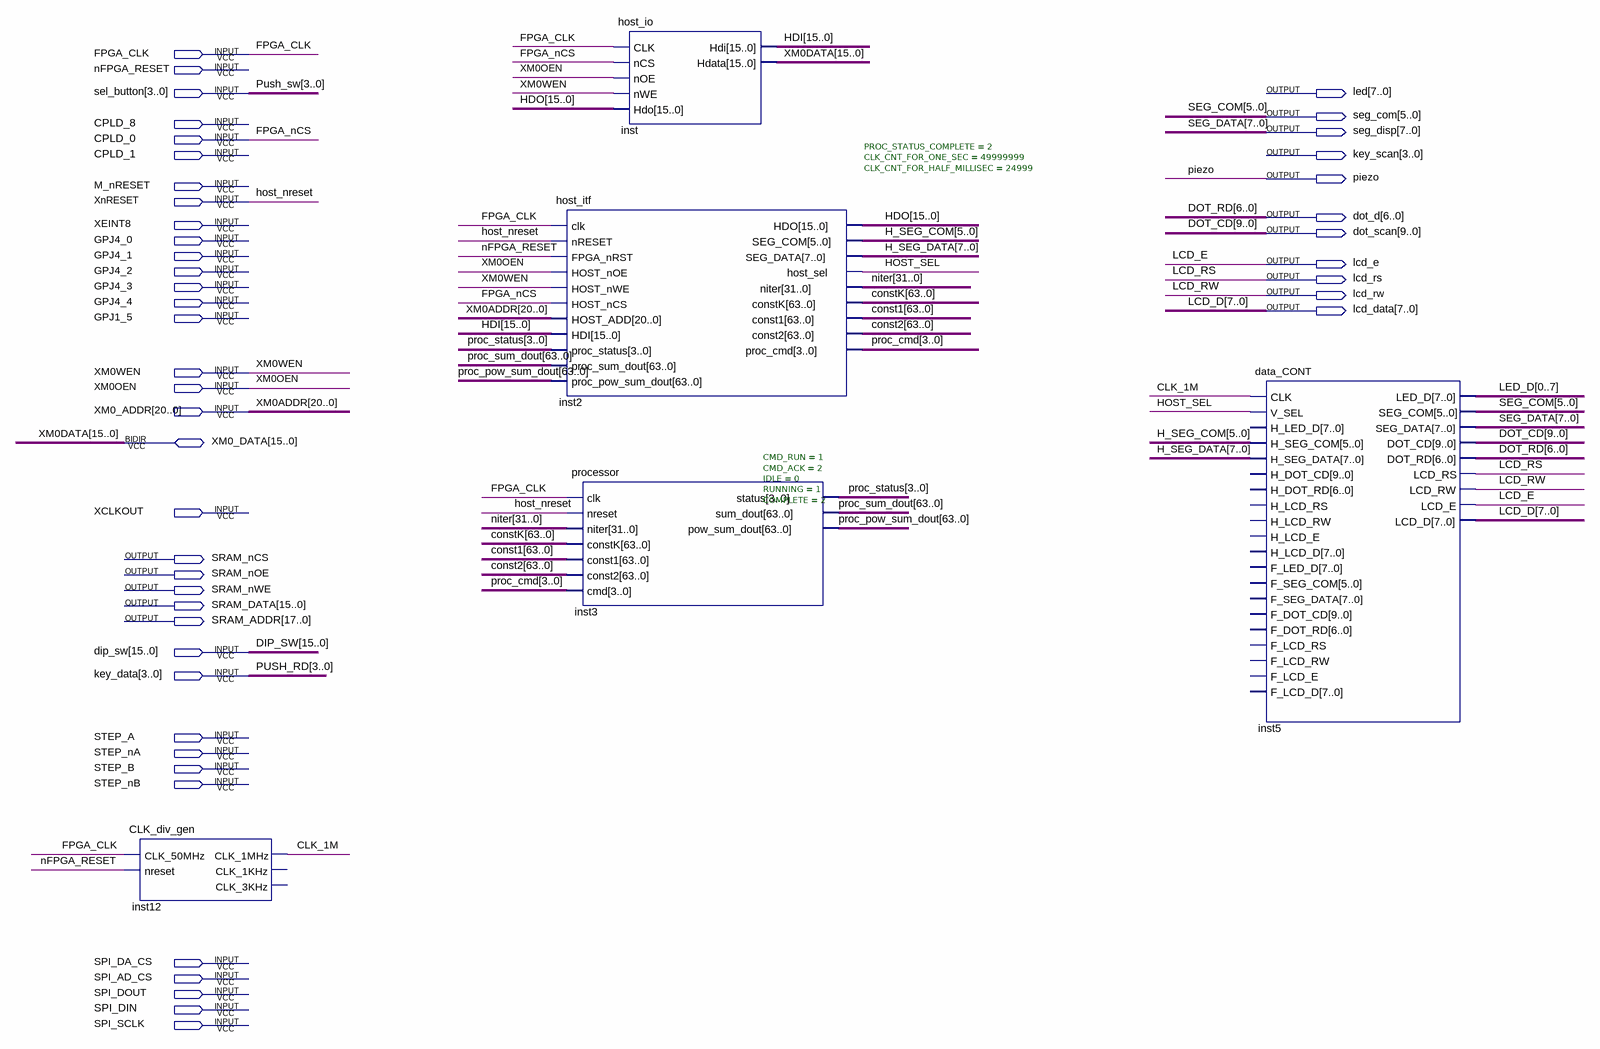
[diagram p0: schematic sheet]
// Quartus schematic M3.bdf as structural Verilog: 5 symbols, 47 pins
module M3 (
  input  FPGA_CLK,
  input  nFPGA_RESET,
  input  [3:0] sel_button,
  input  CPLD_8,
  input  CPLD_0,
  input  CPLD_1,
  input  M_nRESET,
  input  XnRESET,
  input  XEINT8,
  input  GPJ4_0,
  input  GPJ4_1,
  input  GPJ4_2,
  input  GPJ4_3,
  input  GPJ4_4,
  input  GPJ1_5,
  input  XM0WEN,
  input  XM0OEN,
  input  [20:0] XM0_ADDR,
  input  XCLKOUT,
  input  [15:0] dip_sw,
  input  [3:0] key_data,
  input  STEP_A,
  input  STEP_nA,
  input  STEP_B,
  input  STEP_nB,
  input  SPI_DA_CS,
  input  SPI_AD_CS,
  input  SPI_DOUT,
  input  SPI_DIN,
  input  SPI_SCLK,
  inout  [15:0] XM0_DATA,
  output [7:0] led,
  output [5:0] seg_com,
  output [7:0] seg_disp,
  output [3:0] key_scan,
  output piezo,
  output [6:0] dot_d,
  output [9:0] dot_scan,
  output lcd_e,
  output lcd_rs,
  output lcd_rw,
  output [7:0] lcd_data,
  output SRAM_nCS,
  output SRAM_nOE,
  output SRAM_nWE,
  output [15:0] SRAM_DATA,
  output [17:0] SRAM_ADDR
);

  wire CLK_1M, HOST_SEL;
  wire [3:0] proc_cmd, proc_status;
  wire [5:0] H_SEG_COM;
  wire [7:0] H_SEG_DATA, LED_D;
  wire [15:0] HDI, HDO;
  wire [31:0] niter;
  wire [63:0] const1, const2, constK, proc_pow_sum_dout, proc_sum_dout;

  CLK_div_gen inst12 (.CLK_50MHz(FPGA_CLK), .nreset(nFPGA_RESET), .CLK_1MHz(CLK_1M));  // open: CLK_1KHz, CLK_3KHz
  host_itf #(.PROC_STATUS_COMPLETE(2), .CLK_CNT_FOR_ONE_SEC(49999999), .CLK_CNT_FOR_HALF_MILLISEC(24999)) inst2 (
    .clk(FPGA_CLK), .nRESET(XnRESET), .FPGA_nRST(nFPGA_RESET), .HOST_nOE(XM0OEN), .HOST_nWE(XM0WEN),
    .HOST_nCS(CPLD_0), .HOST_ADD(XM0_ADDR), .HDI(HDI), .proc_status(proc_status),
    .proc_sum_dout(proc_sum_dout), .proc_pow_sum_dout(proc_pow_sum_dout), .HDO(HDO), .SEG_COM(H_SEG_COM),
    .SEG_DATA(H_SEG_DATA), .host_sel(HOST_SEL), .niter(niter), .constK(constK), .const1(const1),
    .const2(const2), .proc_cmd(proc_cmd));
  processor #(.CMD_RUN(1), .CMD_ACK(2), .IDLE(0), .RUNNING(1), .COMPLETE(2)) inst3 (
    .clk(FPGA_CLK), .nreset(XnRESET), .niter(niter), .constK(constK), .const1(const1), .const2(const2),
    .cmd(proc_cmd), .status(proc_status), .sum_dout(proc_sum_dout), .pow_sum_dout(proc_pow_sum_dout));
  host_io inst (.CLK(FPGA_CLK), .nCS(CPLD_0), .nOE(XM0OEN), .nWE(XM0WEN), .Hdo(HDO), .Hdi(HDI), .Hdata(XM0_DATA));
  data_CONT inst5 (
    .CLK(CLK_1M), .V_SEL(HOST_SEL), .H_SEG_COM(H_SEG_COM), .H_SEG_DATA(H_SEG_DATA),
    .LED_D({LED_D[0], LED_D[1], LED_D[2], LED_D[3], LED_D[4], LED_D[5], LED_D[6], LED_D[7]}),
    .SEG_COM(seg_com), .SEG_DATA(seg_disp), .DOT_CD(dot_scan), .DOT_RD(dot_d), .LCD_RS(lcd_rs),
    .LCD_RW(lcd_rw), .LCD_E(lcd_e), .LCD_D(lcd_data));  // open: H_LED_D, H_DOT_CD, H_DOT_RD, H_LCD_RS, H_LCD_RW, H_LCD_E, H_LCD_D, F_LED_D, F_SEG_COM, F_SEG_DATA, F_DOT_CD, F_DOT_RD, F_LCD_RS, F_LCD_RW, F_LCD_E, F_LCD_D

  // Other names for the same wires on the sheet: DOT_CD[9:0] = dot_scan; DOT_RD[6:0] = dot_d; FPGA_nCS = CPLD_0;
  //   host_nreset = XnRESET; LCD_D[7:0] = lcd_data; PUSH_RD[3:0] = key_data; Push_sw[3:0] = sel_button;
  //   SEG_DATA[7:0] = seg_disp; XM0ADDR[20:0] = XM0_ADDR; XM0DATA[15:0] = XM0_DATA
endmodule
